# EAGLE design stepper_board (EAGLE 6.6.0)
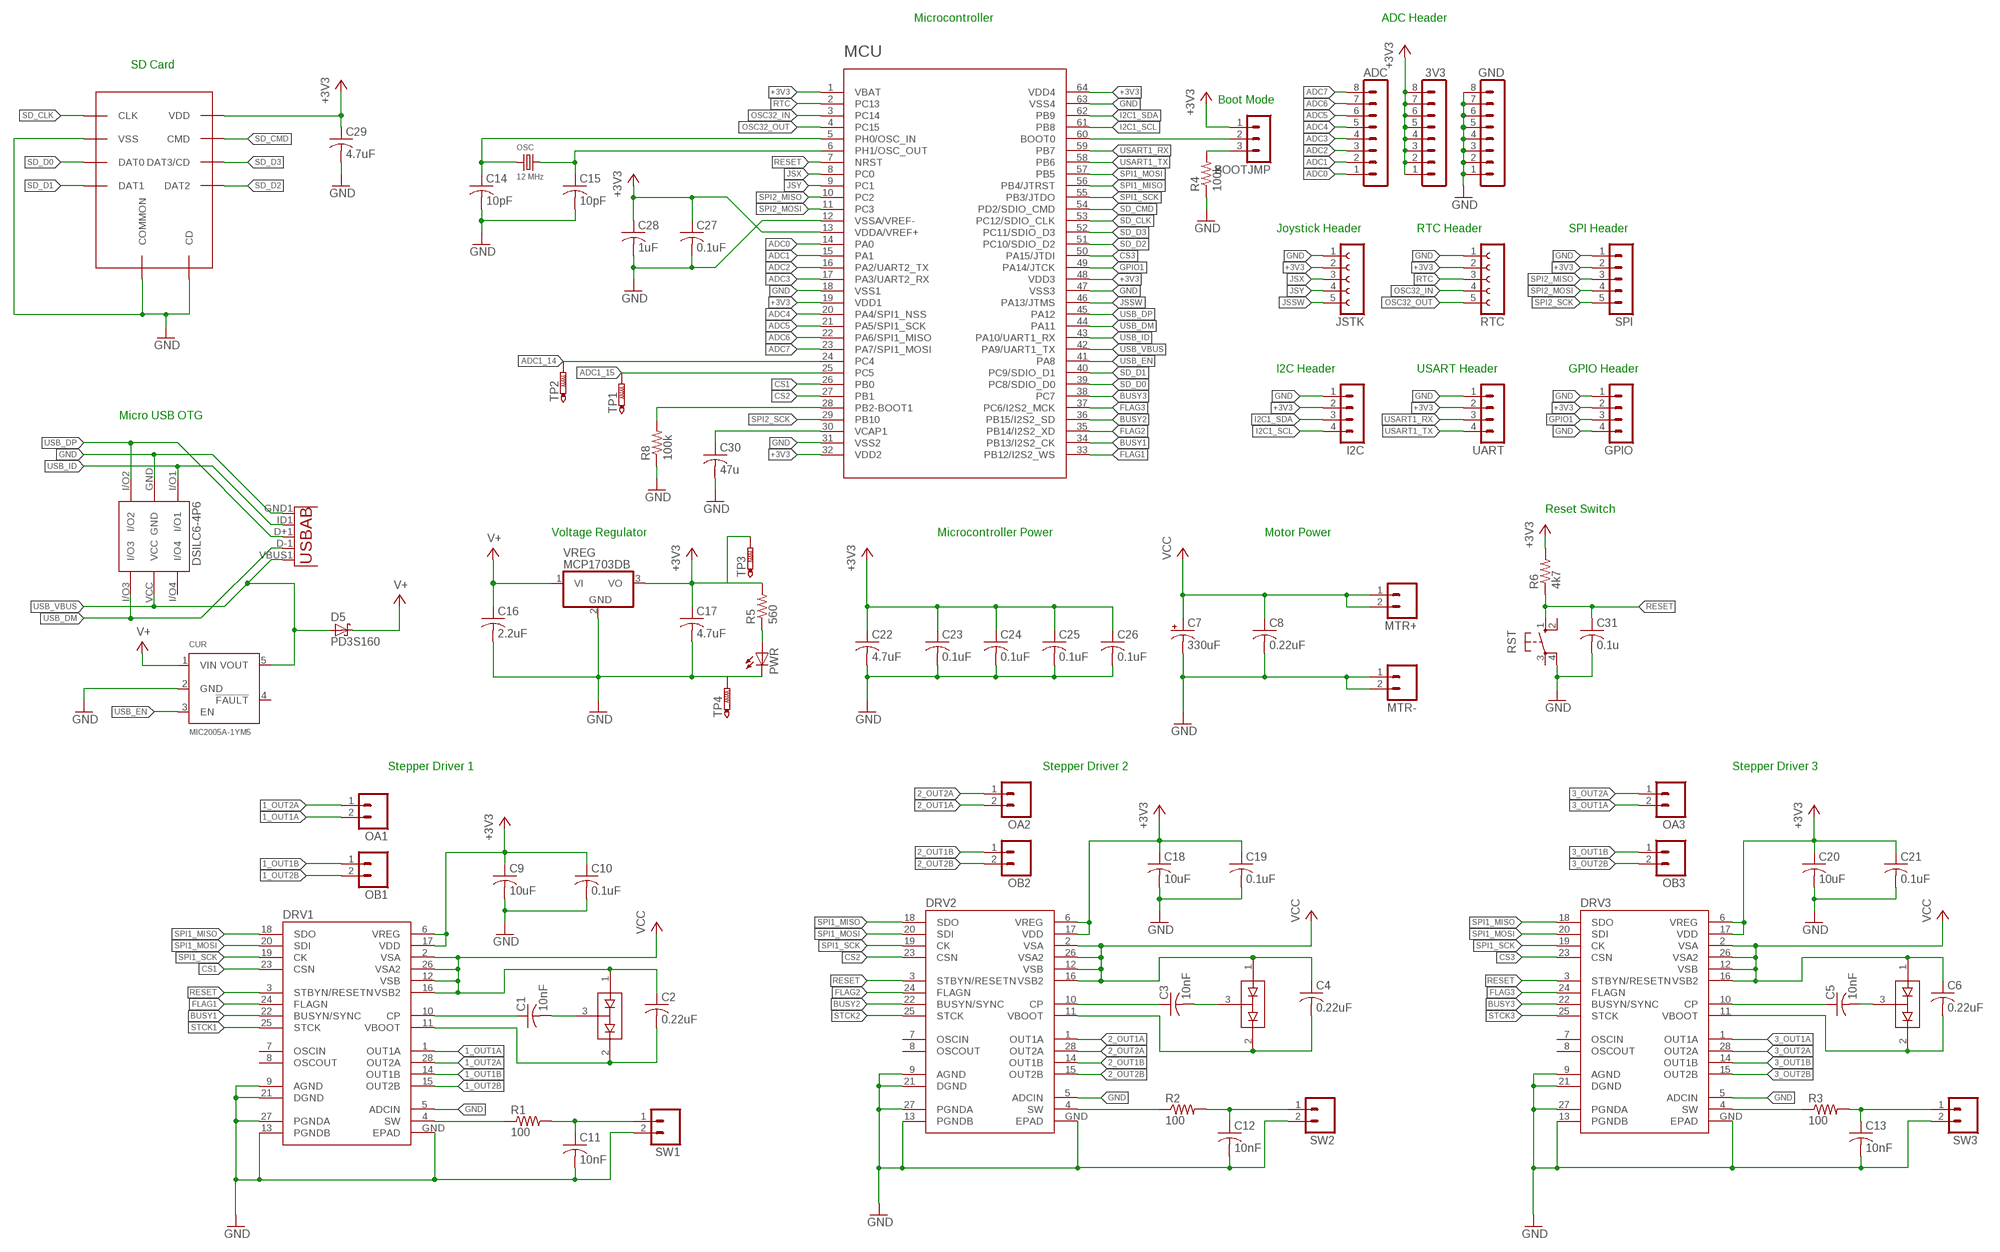
[diagram p0: schematic, sheet 1]

## Parts
3V3  MA08-1  [MA08-1]
ADC  MA08-1  [MA08-1]
BOOTJMP  MA03-1  [MA03-1]
C1  10nF  C-USC0805  [C0805]
C2  0.22uF  C-USC0805  [C0805]
C3  10nF  C-USC0805  [C0805]
C4  0.22uF  C-USC0805  [C0805]
C5  10nF  C-USC0805  [C0805]
C6  0.22uF  C-USC0805  [C0805]
C7  330uF  CPOL-USUD-10X10  [UD-10X10_NICHICON]
C8  0.22uF  C-USC0805  [C0805]
C9  10uF  C-USC0805  [C0805]
C10  0.1uF  C-USC0805  [C0805]
C11  10nF  C-USC0805  [C0805]
C12  10nF  C-USC0805  [C0805]
C13  10nF  C-USC0805  [C0805]
C14  10pF  C-USC0805  [C0805]
C15  10pF  C-USC0805  [C0805]
C16  2.2uF  C-USC0805  [C0805]
C17  4.7uF  C-USC0805  [C0805]
C18  10uF  C-USC0805  [C0805]
C19  0.1uF  C-USC0805  [C0805]
C20  10uF  C-USC0805  [C0805]
C21  0.1uF  C-USC0805  [C0805]
C22  4.7uF  C-USC0805  [C0805]
C23  0.1uF  C-USC0805  [C0805]
C24  0.1uF  C-USC0805  [C0805]
C25  0.1uF  C-USC0805  [C0805]
C26  0.1uF  C-USC0805  [C0805]
C27  0.1uF  C-USC0805  [C0805]
C28  1uF  C-USC0805  [C0805]
C29  4.7uF  C-USC0805  [C0805]
C30  47u  C-USC0805  [C0805]
C31  0.1u  C-USC0805  [C0805]
CUR  MIC2005A-1YM5  [SOT23-5]
D1  BAV99  [SOT23]
D2  BAV99  [SOT23]
D3  BAV99  [SOT23]
D5  PD3S160  [POWERDI323]
DRV1  L6470  [HTSSOP28-NOPAD]
DRV2  L6470  [HTSSOP28-NOPAD]
DRV3  L6470  [HTSSOP28-NOPAD]
ESD  DSILC6-4P6  [SOT-666]
GND  MA08-1  [MA08-1]
GPIO  MA04-1  [MA04-1]
I2C  MA04-1  [MA04-1]
JSTK  FE05-1  [FE05-1]
MCU  STM32F411RE  [TQFP64]
MICROSD  SCHA5B0200  [SCHA5B0200]
MTR+  M02  [02P]
MTR-  M02  [02P]
OA1  M02  [02P]
OA2  M02  [02P]
OA3  M02  [02P]
OB1  M02  [02P]
OB2  M02  [02P]
OB3  M02  [02P]
OSC  12 MHz  CRYSTAL.3.2X2.5MM  [3.2X2.5MM]
PWR  LEDCHIP-LED0805  [CHIP-LED0805]
R1  100  R-US_R0805  [R0805]
R2  100  R-US_R0805  [R0805]
R3  100  R-US_R0805  [R0805]
R4  100k  R-US_R0805  [R0805]
R5  560  R-US_R0805  [R0805]
R6  4k7  R-US_R0805  [R0805]
R8  100k  R-US_R0805  [R0805]
RST  10-XX  [B3F-10XX]
RTC  FE05-1  [FE05-1]
SPI  MA05-1  [MA05-1]
SW1  M02  [02P]
SW2  M02  [02P]
SW3  M02  [02P]
TP1  PTR1B1,27  [B1,27]
TP2  PTR1B1,27  [B1,27]
TP3  PTR1B1,27  [B1,27]
TP4  PTR1B1,27  [B1,27]
UART  MA04-1  [MA04-1]
USB  USB""  [USB-MICRO-SMD]
VREG  MCP1703DB  [SOT223]

## Nets
1_OUT1A: DRV1.1(OUT1A) OA1.2
1_OUT1B: DRV1.14(OUT1B) OB1.1
1_OUT2A: DRV1.28(OUT2A) OA1.1
1_OUT2B: DRV1.15(OUT2B) OB1.2
2_OUT1A: DRV2.1(OUT1A) OA2.2
2_OUT1B: DRV2.14(OUT1B) OB2.1
2_OUT2A: DRV2.28(OUT2A) OA2.1
2_OUT2B: DRV2.15(OUT2B) OB2.2
3_OUT1A: DRV3.1(OUT1A) OA3.2
3_OUT1B: DRV3.14(OUT1B) OB3.1
3_OUT2A: DRV3.28(OUT2A) OA3.1
3_OUT2B: DRV3.15(OUT2B) OB3.2
+3V3: 3V3.1 3V3.2 3V3.3 3V3.4 3V3.5 3V3.6 3V3.7 3V3.8 BOOTJMP.1 C9.1 C10.1 C17.1 C18.1 C19.1 C20.1 C21.1 C22.1 C23.1 C24.1 C25.1 C26.1 C27.1 C28.1 C29.1 DRV1.6(VREG) DRV1.17(VDD) DRV2.6(VREG) DRV2.17(VDD) DRV3.6(VREG) DRV3.17(VDD) GPIO.2 I2C.2 JSTK.2 MCU.1(VBAT) MCU.13(VDDA/VREF+) MCU.19(VDD1) MCU.32(VDD2) MCU.48(VDD3) MCU.64(VDD4) MICROSD.VDD R5.2 R6.2 RTC.2 SPI.2 TP3.TP UART.2 VREG.3(VO)
ADC0: ADC.1 MCU.14(PA0)
ADC1: ADC.2 MCU.15(PA1)
ADC1_14: MCU.24(PC4) TP2.TP
ADC1_15: MCU.25(PC5) TP1.TP
ADC2: ADC.3 MCU.16(PA2/UART2_TX)
ADC3: ADC.4 MCU.17(PA3/UART2_RX)
ADC4: ADC.5 MCU.20(PA4/SPI1_NSS)
ADC5: ADC.6 MCU.21(PA5/SPI1_SCK)
ADC6: ADC.7 MCU.22(PA6/SPI1_MISO)
ADC7: ADC.8 MCU.23(PA7/SPI1_MOSI)
BUSY1: DRV1.22(BUSYN/SYNC) MCU.34(PB13/I2S2_CK)
BUSY2: DRV2.22(BUSYN/SYNC) MCU.36(PB15/I2S2_SD)
BUSY3: DRV3.22(BUSYN/SYNC) MCU.38(PC7)
CS1: DRV1.23(CSN) MCU.26(PB0)
CS2: DRV2.23(CSN) MCU.27(PB1)
CS3: DRV3.23(CSN) MCU.50(PA15/JTDI)
FLAG1: DRV1.24(FLAGN) MCU.33(PB12/I2S2_WS)
FLAG2: DRV2.24(FLAGN) MCU.35(PB14/I2S2_XD)
FLAG3: DRV3.24(FLAGN) MCU.37(PC6/I2S2_MCK)
GND: C7.- C8.2 C9.2 C10.2 C11.2 C12.2 C13.2 C14.2 C15.2 C16.2 C17.2 C18.2 C19.2 C20.2 C21.2 C22.2 C23.2 C24.2 C25.2 C26.2 C27.2 C28.2 C29.2 C30.2 C31.2 CUR.2(GND) DRV1.5(ADCIN) DRV1.9(AGND) DRV1.13(PGNDB) DRV1.21(DGND) DRV1.27(PGNDA) DRV1.GND(EPAD) DRV2.5(ADCIN) DRV2.9(AGND) DRV2.13(PGNDB) DRV2.21(DGND) DRV2.27(PGNDA) DRV2.GND(EPAD) DRV3.5(ADCIN) DRV3.9(AGND) DRV3.13(PGNDB) DRV3.21(DGND) DRV3.27(PGNDA) DRV3.GND(EPAD) ESD.GND GND.1 GND.2 GND.3 GND.4 GND.5 GND.6 GND.7 GND.8 GPIO.1 GPIO.4 I2C.1 JSTK.1 MCU.12(VSSA/VREF-) MCU.18(VSS1) MCU.31(VSS2) MCU.47(VSS3) MCU.63(VSS4) MICROSD.CD_SW(CD) MICROSD.COMMON MICROSD.VSS MTR-.1 MTR-.2 PWR.C R4.1 R8.1 RST.4(P1) RTC.1 SPI.1 SW1.2 SW2.2 SW3.2 TP4.TP UART.1 USB.GND1(GND) VREG.2(GND)
GPIO1: GPIO.3 MCU.49(PA14/JTCK)
I2C1_SCL: I2C.4 MCU.61(PB8)
I2C1_SDA: I2C.3 MCU.62(PB9)
JSSW: JSTK.5 MCU.46(PA13/JTMS)
JSX: JSTK.3 MCU.8(PC0)
JSY: JSTK.4 MCU.9(PC1)
N$1: C1.1 DRV1.10(CP)
N$2: C1.2 D1.3(COM)
N$3: C2.2 D1.2(C2) DRV1.11(VBOOT)
N$4: C3.1 DRV2.10(CP)
N$5: C3.2 D2.3(COM)
N$6: C4.2 D2.2(C2) DRV2.11(VBOOT)
N$7: DRV1.4(SW) R1.1
N$8: C5.1 DRV3.10(CP)
N$9: C5.2 D3.3(COM)
N$10: C6.2 D3.2(C2) DRV3.11(VBOOT)
N$11: C11.1 R1.2 SW1.1
N$12: DRV2.4(SW) R2.1
N$13: C12.1 R2.2 SW2.1
N$14: DRV3.4(SW) R3.1
N$15: C13.1 R3.2 SW3.1
N$16: C14.1 MCU.5(PH0/OSC_IN) OSC.1
N$17: C15.1 MCU.6(PH1/OSC_OUT) OSC.3
N$18: BOOTJMP.2 MCU.60(BOOT0)
N$19: BOOTJMP.3 R4.2
N$20: PWR.A R5.1
N$22: C30.1 MCU.30(VCAP1)
N$23: MCU.28(PB2-BOOT1) R8.2
OSC32_IN: MCU.3(PC14) RTC.4
OSC32_OUT: MCU.4(PC15) RTC.5
RESET: C31.1 DRV1.3(STBYN/RESETN) DRV2.3(STBYN/RESETN) DRV3.3(STBYN/RESETN) MCU.7(NRST) R6.1 RST.1(S)
RTC: MCU.2(PC13) RTC.3
SD_CLK: MCU.53(PC12/SDIO_CLK) MICROSD.CLK
SD_CMD: MCU.54(PD2/SDIO_CMD) MICROSD.CMD
SD_D0: MCU.39(PC8/SDIO_D0) MICROSD.DAT0
SD_D1: MCU.40(PC9/SDIO_D1) MICROSD.DAT1
SD_D2: MCU.51(PC10/SDIO_D2) MICROSD.DAT2
SD_D3: MCU.52(PC11/SDIO_D3) MICROSD.DAT3/CD
SPI1_MISO: DRV1.18(SDO) DRV2.18(SDO) DRV3.18(SDO) MCU.56(PB4/JTRST)
SPI1_MOSI: DRV1.20(SDI) DRV2.20(SDI) DRV3.20(SDI) MCU.57(PB5)
SPI1_SCK: DRV1.19(CK) DRV2.19(CK) DRV3.19(CK) MCU.55(PB3/JTDO)
SPI2_MISO: MCU.10(PC2) SPI.3
SPI2_MOSI: MCU.11(PC3) SPI.4
SPI2_SCK: MCU.29(PB10) SPI.5
STCK1: DRV1.25(STCK)
STCK2: DRV2.25(STCK)
STCK3: DRV3.25(STCK)
USART1_RX: MCU.59(PB7) UART.3
USART1_TX: MCU.58(PB6) UART.4
USB_DM: ESD.I/O3 MCU.44(PA11) USB.D-1(D-)
USB_DP: ESD.I/O2 MCU.45(PA12) USB.D+1(D+)
USB_EN: CUR.3(EN) MCU.41(PA8)
USB_ID: ESD.I/O1 MCU.43(PA10/UART1_RX) USB.ID1(USBID)
USB_VBUS: CUR.5(VOUT) D5.A ESD.VCC MCU.42(PA9/UART1_TX) USB.VBUS1(VBUS)
V+: C16.1 CUR.1(VIN) D5.C VREG.1(VI)
VCC: C2.1 C4.1 C6.1 C7.+ C8.1 D1.1(A1) D2.1(A1) D3.1(A1) DRV1.2(VSA) DRV1.12(VSB) DRV1.16(VSB2) DRV1.26(VSA2) DRV2.2(VSA) DRV2.12(VSB) DRV2.16(VSB2) DRV2.26(VSA2) DRV3.2(VSA) DRV3.12(VSB) DRV3.16(VSB2) DRV3.26(VSA2) MTR+.1 MTR+.2
Unconnected: CUR.4(!FAULT) DRV1.7(OSCIN) DRV1.8(OSCOUT) DRV2.7(OSCIN) DRV2.8(OSCOUT) DRV3.7(OSCIN) DRV3.8(OSCOUT) ESD.I/O4 RST.2(S1) RST.3(P)

## Notes on the sheet
- Microcontroller | ADC Header
- SD Card
- Boot Mode
- Joystick Header | RTC Header | SPI Header
- I2C Header | USART Header | GPIO Header
- Micro USB OTG
- Reset Switch
- Voltage Regulator | Microcontroller Power | Motor Power
- Stepper Driver 1 | Stepper Driver 2 | Stepper Driver 3

## Library data of the parts
3V3 ADC GND = con-lstb:MA08-1: PIN HEADER; OC_FARNELL: unknown; OC_NEWARK: unknown
BOOTJMP = con-lstb:MA03-1: PIN HEADER; OC_FARNELL: unknown; OC_NEWARK: unknown
C1-C6 C8-C31 = rcl:C-US: CAPACITOR, American symbol
C7 = rcl:CPOL-US: POLARIZED CAPACITOR, American symbol
CUR = Power_Switch:MIC2005A-1: 0.5A Current Limiting Power Distribution Switch Current limit 0.5A, Enable signal active high; RS: 727-4731
D1-D3 = DiscreteSemi:BAV99: Two small signal silicon diodes connected anode to cathode. Connections to all three nodes available.
D5 = diode:PD3S160: 1.0A SURFACE MOUNT SCHOTTKY BARRIER RECTIFIER POWERDI ® 323 Source: http://www.diodes.com/datasheets/ds30899.pdf
DRV1-DRV3 = PowerIC_spark:L6470: 3A RMS/7A peak bipolar stepper motor driver with SPI control and step input in HTSSOP-28 package. IC-10648
ESD = Stepper_Driver:DSILC6-4P6: ESD Protection IC for high speed interface (i.e. USB, Ethernet, display and camera serial interfaces.
GPIO I2C UART = con-lstb:MA04-1: PIN HEADER; OC_FARNELL: unknown; OC_NEWARK: unknown
JSTK RTC = con-lsta:FE05-1: FEMALE HEADER; OC_FARNELL: unknown; OC_NEWARK: unknown
MCU = DigitalIC:STM32F411RE: 100MHz ARM Cortex M4 with 512kb flash and 128kb RAM
MICROSD = SCHA5B0200_hand:SCHA5B0200: Memory Card Connectors microSD Rev Mount Push-push w/Switch; MANUF: ALPS; PARTNUM: SCHA5B0200
MTR+ MTR- OA1-OA3 OB1-OB3 SW1-SW3 = con-amp-quick:M02: AMP QUICK CONNECTOR; OC_FARNELL: unknown; OC_NEWARK: unknown
OSC = abracon:CRYSTAL
PWR = led:LED: LED OSRAM: - CHIPLED LG R971, LG N971, LY N971, LG Q971, LY Q971, LO R971, LY R971 LH N974, LH R974 LS Q976, LO Q976, LY Q976 LO Q996 - Hyper CHIPLED LW Q18S LB Q993, LB Q99A, LB R99A - SideLED LS A670, LO A670, LY A670, LG A670, LP A670 LB A673, LV A673, LT A673, LW A673 LH A674 LY A675 LS A676, LA A676, LO A676, LY A676, LW A676 LS A679, LY A679, LG A679 - Hyper Micro SIDELED® LS Y876, LA Y876, LO Y876, LY Y876 LT Y87S - SmartLED LW L88C, LW L88S LB L89C, LB L89S, LG L890 LS L89K, LO L89K, LY L89K LS L896, LA L896, LO L896, LY L896 - TOPLED LS T670, LO T670, LY T670, LG T670, LP T670 LSG T670, LSP T670, LSY T670, LOP T670, LYG T670 LG T671, LOG T671, LSG T671 LB T673, LV T673, LT T673, LW T673 LH T674 LS T676, LA T676, LO T676, LY T676, LB T676, LH T676, LSB T676, LW T676 LB T67C, LV T67C, LT T67C, LS T67K, LO T67K, LY T67K, LW E67C LS E67B, LA E67B, LO E67B, LY E67B, LB E67C, LV E67C, LT E67C LW T67C LS T679, LY T679, LG T679 LS T770, LO T770, LY T770, LG T770, LP T770 LB T773, LV T773, LT T773, LW T773 LH T774 LS E675, LA E675, LY E675, LS T675 LS T776, LA T776, LO T776, LY T776, LB T776 LHGB T686 LT T68C, LB T68C - Hyper Mini TOPLED® LB M676 - Mini TOPLED Santana® LG M470 LS M47K, LO M47K, LY M47K Source: http://www.osram.convergy.de LUXEON: - LUMILED® LXK2-PW12-R00, LXK2-PW12-S00, LXK2-PW14-U00, LXK2-PW14-V00 LXK2-PM12-R00, LXK2-PM12-S00, LXK2-PM14-U00 LXK2-PE12-Q00, LXK2-PE12-R00, LXK2-PE12-S00, LXK2-PE14-T00, LXK2-PE14-U00 LXK2-PB12-K00, LXK2-PB12-L00, LXK2-PB12-M00, LXK2-PB14-N00, LXK2-PB14-P00, LXK2-PB14-Q00 LXK2-PR12-L00, LXK2-PR12-M00, LXK2-PR14-Q00, LXK2-PR14-R00 LXK2-PD12-Q00, LXK2-PD12-R00, LXK2-PD12-S00 LXK2-PH12-R00, LXK2-PH12-S00 LXK2-PL12-P00, LXK2-PL12-Q00, LXK2-PL12-R00 Source: www.luxeon.com KINGBRIGHT: KA-3528ASYC Source: www.kingbright.com
R1-R3 = resistor:R-US_: RESISTOR, American symbol
R4-R6 R8 = rcl:R-US_: RESISTOR, American symbol
RST = switch-omron:10-XX: OMRON SWITCH; MPN: B3F-1000; OC_FARNELL: 176432; OC_NEWARK: 36M3542
SPI = con-lstb:MA05-1: PIN HEADER; OC_FARNELL: unknown; OC_NEWARK: unknown
TP1-TP4 = testpad:PTR1: TEST PIN
USB = MicroUSB:USB: This is a USB AB connector that is compatible with USB OTG. i.e. this connector can serve as a host or device
VREG = linear:MCP1703: 250 mA, 16V, Low Quiescent Current LDO Regulator Source: http://ww1.microchip.com/downloads/en/DeviceDoc/22049b.pdf

## Board
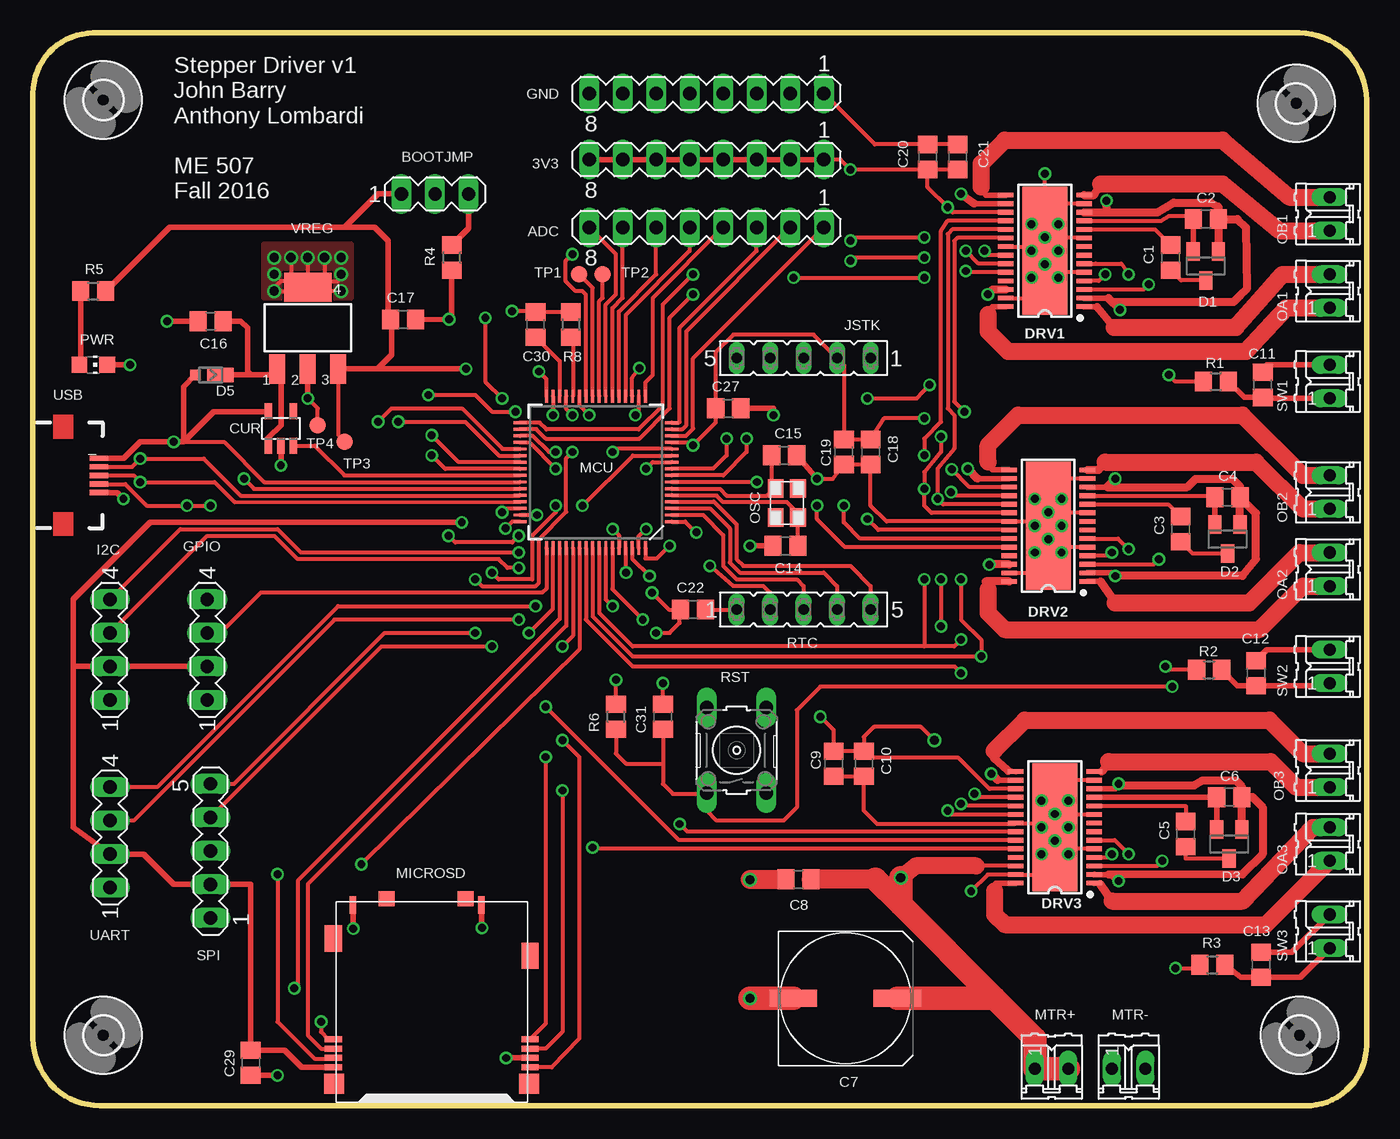
[diagram p1: board, top side]
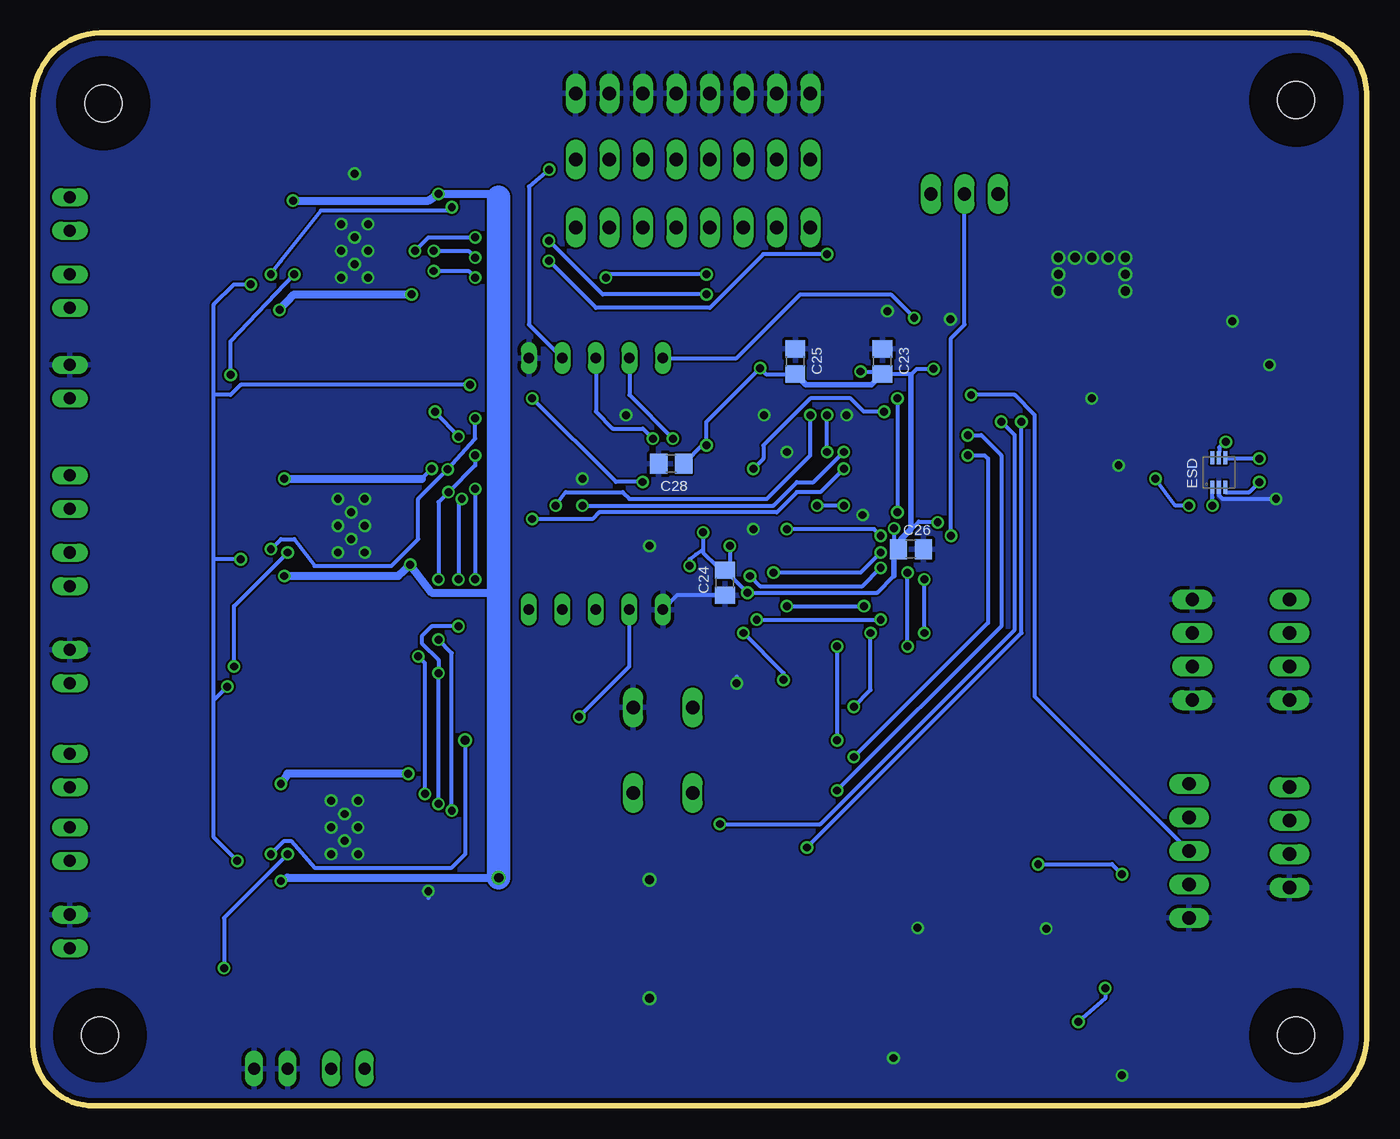
[diagram p2: board, bottom side, seen from below]

Size 101.09 x 81.31 mm. Coordinates in mm from the lower left corner, seen from the top.
Outline: 5.08,0.03 arc-90 0,5.11 0,76.73 arc-90 4.57,81.31 96.01,81.31 arc-90 101.09,76.23 101.09,4.6 arc-96 96.01,0.03 5.08,0.03
Copper layers (1*16): Top 0.0356mm / dielectric 1.5011mm / Bottom 0.0356mm
Design rules "oshpark-2layer": minimum track width 6mil, minimum drill 13mil, track to track 6mil, track to pad 6mil, pad to pad 6mil, via to via 6mil, smd to smd 6mil, copper to edge 15mil, drill to drill 6mil, minimum pad ring 7mil, minimum via ring 7mil, stop-mask expansion 2.5mil, vias tented up to drill 0mil, thermal gap 10mil

### Footprints (pad centres in the part's own frame; a part is rotated, then mirrored left to right if it is on the bottom)
MA08-1 = drill 1.016 long: 1 -8.89,0; 2 -6.35,0; 3 -3.81,0; 4 -1.27,0; 5 1.27,0; 6 3.81,0; 7 6.35,0; 8 8.89,0
MA03-1 = drill 1.016 long: 1 -2.54,0; 2 0,0; 3 2.54,0
C0805 = smd 1.3 x 1.5: 1 -0.95,0; 2 0.95,0
UD-10X10_NICHICON = smd 3.6 x 1.3: + 3.925,0; - -3.95,0
SOT23-5 = smd 0.55 x 1.2: 1 -0.95,-1.3; 2 0,-1.3; 3 0.95,-1.3; 4 0.95,1.3; 5 -0.95,1.3
SOT23 = smd 1 x 1.4: 1 -0.95,-1.1; 2 0.95,-1.1; 3 0,1.1
POWERDI323 = smd 0.8 x 0.8: A 1.15,0 | smd 2 x 1.1: C -0.75,0
HTSSOP28-NOPAD = smd 0.36 x 1.19: 1 -4.225,-2.97; 2 -3.575,-2.97; 3 -2.925,-2.97; 4 -2.275,-2.97; 5 -1.625,-2.97; 6 -0.975,-2.97; 7 -0.325,-2.97; 8 0.325,-2.97; 9 0.975,-2.97; 10 1.625,-2.97; 11 2.275,-2.97; 12 2.925,-2.97; 13 3.575,-2.97; 14 4.225,-2.97; 15 4.225,2.97; 16 3.575,2.97; 17 2.925,2.97; 18 2.275,2.97; 19 1.625,2.97; 20 0.975,2.97; 21 0.325,2.97; 22 -0.325,2.97; 23 -0.975,2.97; 24 -1.625,2.97; 25 -2.275,2.97; 26 -2.925,2.97; 27 -3.575,2.97; 28 -4.225,2.97 | smd 9.7 x 3.4: GND 0,0
SOT-666 = smd 1 x 0.3: GND -1.12,0.02; I/O1 -1.12,0.52; I/O2 -1.12,-0.48; I/O3 1.12,-0.48; I/O4 1.12,0.52; VCC 1.12,0.02
MA04-1 = drill 1.016 long: 1 -3.81,0; 2 -1.27,0; 3 1.27,0; 4 3.81,0
FE05-1 = drill 0.813 long: 1 -5.08,0; 2 -2.54,0; 3 0,0; 4 2.54,0; 5 5.08,0
TQFP64 = smd 0.22 x 1: 1 -3.75,-5.75; 2 -3.25,-5.75; 3 -2.75,-5.75; 4 -2.25,-5.75; 5 -1.75,-5.75; 6 -1.25,-5.75; 7 -0.75,-5.75; 8 -0.25,-5.75; 9 0.25,-5.75; 10 0.75,-5.75; 11 1.25,-5.75; 12 1.75,-5.75; 13 2.25,-5.75; 14 2.75,-5.75; 15 3.25,-5.75; 16 3.75,-5.75; 33 3.75,5.75; 34 3.25,5.75; 35 2.75,5.75; 36 2.25,5.75; 37 1.75,5.75; 38 1.25,5.75; 39 0.75,5.75; 40 0.25,5.75; 41 -0.25,5.75; 42 -0.75,5.75; 43 -1.25,5.75; 44 -1.75,5.75; 45 -2.25,5.75; 46 -2.75,5.75; 47 -3.25,5.75; 48 -3.75,5.75 | smd 1 x 0.22: 17 5.75,-3.75; 18 5.75,-3.25; 19 5.75,-2.75; 20 5.75,-2.25; 21 5.75,-1.75; 22 5.75,-1.25; 23 5.75,-0.75; 24 5.75,-0.25; 25 5.75,0.25; 26 5.75,0.75; 27 5.75,1.25; 28 5.75,1.75; 29 5.75,2.25; 30 5.75,2.75; 31 5.75,3.25; 32 5.75,3.75; 49 -5.75,3.75; 50 -5.75,3.25; 51 -5.75,2.75; 52 -5.75,2.25; 53 -5.75,1.75; 54 -5.75,1.25; 55 -5.75,0.75; 56 -5.75,0.25; 57 -5.75,-0.25; 58 -5.75,-0.75; 59 -5.75,-1.25; 60 -5.75,-1.75; 61 -5.75,-2.25; 62 -5.75,-2.75; 63 -5.75,-3.25; 64 -5.75,-3.75
SCHA5B0200 = smd 0.5 x 1.3: CD_SW -5.975,13.55; COMMON 3.775,13.55 | smd 1.3 x 0.45: CLK 7.45,1.265; CMD -7.45,1.965; DAT0 7.45,2.665; DAT1 7.45,3.365; DAT2 -7.45,3.365; DAT3/CD -7.45,2.665; VDD -7.45,1.265; VSS 7.45,1.965 | smd 1.5 x 1.5: P$1 -7.388,0; P$2 7.388,0 | smd 1.3 x 2: P$11 -7.45,11; P$12 7.45,9.7 | smd 1.2 x 1.15: P$15 -3.425,14.025; P$16 2.575,14.025
02P = drill 0.914 long: 1 -1.27,0; 2 1.27,0
3.2X2.5MM = smd 1.4 x 1.2: 1 -1.1,-0.85; 2 1.1,-0.85; 3 1.1,0.85; 4 -1.1,0.85
CHIP-LED0805 = smd 1.2 x 1.2: A 0,-1.05; C 0,1.05
R0805 = smd 1.3 x 1.5: 1 -0.95,0; 2 0.95,0
B3F-10XX = drill 1.016 long: 1 -3.251,2.261; 2 3.251,2.261; 3 -3.251,-2.261; 4 3.251,-2.261
MA05-1 = drill 1.016 long: 1 -5.08,0; 2 -2.54,0; 3 0,0; 4 2.54,0; 5 5.08,0
B1,27 = smd 1.27 x 1.27: TP 0,0
2,8 = hole 2.8: 0,0
USB-MICRO-SMD = smd 1.4 x 0.4: D+1 2.7,0; D-1 2.7,0.65; GND1 2.7,-1.3; ID1 2.7,-0.65; VBUS1 2.7,1.3
SOT223 = smd 1.219 x 2.235: 1 -2.311,-3.099; 2 0,-3.099; 3 2.311,-3.099 | smd 3.6 x 2.2: 4 0,3.099

### Placement (x,y rotation side)
3V3  51.05,71.7 180 top
ADC  51.05,66.57 180 top
BOOTJMP  30.48,69.11 0 top
C1  86.23,64.29 270 top
C2  88.9,67.21 180 top
C3  86.99,43.71 270 top
C4  90.55,46.13 180 top
C5  87.38,20.6 270 top
C6  90.68,23.39 180 top
C7  61.6,8.15 0 top
C8  58.04,17.17 180 top
C9  60.71,25.93 270 top
C10  62.99,25.93 270 top
C11  93.22,54.64 90 top
C12  92.71,32.79 90 top
C13  93.09,10.69 90 top
C14  57.05,42.44 180 top
C15  56.95,49.3 0 top
C16  13.46,59.46 180 top
C17  28.07,59.59 0 top
C18  63.5,49.56 270 top
C19  61.47,49.56 270 top
C20  67.82,71.91 90 top
C21  70.1,71.91 90 top
C22  50.04,37.62 0 top
C23  36.7,56.41 90 bottom
C24  48.64,39.65 270 bottom
C25  43.31,56.41 90 bottom
C26  34.54,42.19 0 bottom
C27  52.71,52.86 0 top
C28  52.71,48.67 180 bottom
C29  16.51,3.28 270 top
C30  38.1,59.21 90 top
C31  47.75,29.49 90 top
CUR  18.8,51.33 0 top
D1  88.9,63.65 180 top
D2  90.55,42.95 180 top
D3  90.68,19.84 180 top
D5  13.46,55.4 180 top
DRV1  76.71,64.8 90 top
DRV2  76.96,43.97 90 top
DRV3  77.47,21.11 90 top
ESD  11.18,48.01 90 bottom
GND  51.05,76.73 180 top
GPIO  13.21,34.57 90 top
I2C  5.84,34.57 90 top
JSTK  58.42,56.67 180 top
MCU  42.67,48.03 90 top
MICROSD  30.23,1.68 0 top
MTR+  77.22,2.82 0 top
MTR-  83.06,2.82 0 top
OA1  98.3,61.75 90 top
OA2  98.3,40.67 90 top
OA3  98.3,19.84 90 top
OB1  98.3,67.59 90 top
OB2  98.3,46.51 90 top
OB3  98.3,25.43 90 top
OSC  57.15,45.69 90 top
PWR  4.57,56.16 270 top
R1  89.66,54.89 0 top
R2  89.15,33.05 0 top
R3  89.41,10.69 0 top
R4  31.75,64.29 90 top
R5  4.57,61.75 0 top
R6  44.2,29.49 90 top
R8  40.77,59.21 270 top
RST  53.34,26.95 90 top
RTC  58.42,37.62 0 top
SPI  13.46,19.33 90 top
SW1  98.3,54.89 90 top
SW2  98.3,33.3 90 top
SW3  98.3,13.23 90 top
TP1  41.4,63.02 0 top
TP2  43.18,63.02 0 top
TP3  23.62,50.32 0 top
TP4  21.59,51.59 0 top
U$2  [2,8]  96.01,5.36 0 top
U$3  [2,8]  5.33,5.36 0 top
U$4  [2,8]  5.33,76.23 0 top
U$5  [2,8]  95.76,75.97 0 top
UART  5.84,20.35 90 top
USB  2.29,47.78 0 top
VREG  20.83,58.95 0 top

### Tracks (layer width: path | path; a pad name or v marks a point on that pad's centre or on a via)
1_OUT1A
  Top 0.406: DRV1.1 80.63,60.57 80.67,60.53
  Top 0.61: 81.94,59 80.67,60.53
  Top 1.27: 81.94,59 91.19,59 94.74,63.02 OA1.2
1_OUT1B
  Top 0.61: DRV1.14 80.42,69.02 80.92,69.88
  Top 1.27: 80.92,69.88 90.17,69.88 94.49,66.32 OB1.1
1_OUT2A
  Top 0.406: DRV1.28 72.74,60.57 72.39,59.97
  Top 1.27: 72.39,59.97 72.39,58.7 73.91,57.18 91.95,57.18 95,60.48 OA1.1
1_OUT2B
  Top 0.406: DRV1.15 72.23,69.02 71.88,69.62
  Top 1.27: 71.88,69.62 71.88,71.4 73.66,73.18 90.17,73.18 95.25,68.86 OB1.2
2_OUT1A
  Top 0.406: DRV2.1 80.93,39.74
  Top 0.61: 80.93,39.74 82.04,38.13
  Top 1.27: 82.04,38.13 92.2,38.13 96.01,41.94 OA2.2
2_OUT1B
  Top 0.61: DRV2.14 80.77,48.19 81.28,48.79
  Top 1.27: 81.28,48.79 92.71,48.79 96.27,45.24 OB2.1
2_OUT2A
  Top 0.61: DRV2.28 72.23,39.74 72.39,39.14
  Top 1.27: 72.39,39.14 72.39,37.36 73.66,36.09 92.96,36.09 96.27,39.4 OA2.1
2_OUT2B
  Top 0.406: DRV2.15 72.74,48.19 72.39,48.79
  Top 1.27: 72.39,48.79 72.39,50.06 74.68,52.35 91.69,52.35 96.27,47.78 OB2.2
3_OUT1A
  Top 0.406: DRV3.1 80.88,16.83
  Top 0.61: 80.88,16.83 81.79,15.52
  Top 1.27: 81.79,15.52 91.69,15.52 97.03,21.11 OA3.2
3_OUT1B
  Top 0.305: 81.03,25.33 DRV3.14
  Top 0.61: 81.53,26.09 81.03,25.33
  Top 1.27: 81.53,26.09 93.82,26.09 95.76,24.16 OB3.1
3_OUT2A
  Top 0.406: DRV3.28 72.99,16.88 72.9,16.28
  Top 1.27: 72.9,16.28 72.9,14.5 73.66,13.74 93.47,13.74 OA3.1
3_OUT2B
  Top 0.406: DRV3.15 73.91,25.38
  Top 0.61: 73.91,25.38 72.85,26.34 72.85,26.9
  Top 1.27: 72.85,26.9 75.18,29.24 93.73,29.24 96.27,26.7 OB3.2
+3V3  (via drill 0.6, 0.7)
  Top 0.305: MCU.19 45.42,55.19 v45.97,55.91 | MCU.32 38.92,55.08 v38.35,55.65 | MCU.64 46.42,41.49 47.3,41.49 v48.26,42.44 | MCU.1 49.43,44.27 50.24,43.46 v50.29,43.46 | RTC.2 55.88,38.89 55.37,39.4 53.09,39.4 v51.31,40.92 | MCU.48 36.33,44.28 v35.81,43.76 | DRV3.6 82,20.13 v83.06,19.08 | DRV3.17 72.51,24.03 70.17,26.38 63.5,26.38 C10.1 | C10.1 C9.1 60.71,28.47 v59.69,29.49 | DRV2.6 82.25,42.99 v83.06,42.19 | v67.56,52.1 64.52,52.1 C18.1 C19.1 61.47,56.16 JSTK.2 59.18,58.45 53.09,58.45 51.76,57.11 C27.1 51.76,51.78 v50.04,50.06 49.82,50.28 MCU.13 | DRV2.17 70.99,46.89 v69.65,48.23 | C21.1 C20.1 | DRV1.17 69.72,67.72 v69.34,68.1 67.82,69.62 C20.1 | DRV1.6 80.56,63.82 82.5,63.83 v83.06,63.02 | C20.1 v61.96,70.96 61.21,71.7 3V3.1 | v46.93,38.89 48.2,37.62 C22.1 49.02,37.55 49.02,36.6 48.26,35.84 v47.24,35.84 | VREG.3 23.14,50.85 TP3.TP | v68.33,27.71 67.31,28.73 63.75,28.73 62.99,27.97 C10.1 | R6.2 v44.2,32.28
  Top 0.406: VREG.3 26.11,55.85 | 26.11,55.85 27.18,56.92 27.18,59.53 C17.1 26.92,59.78 26.92,65.56 25.91,66.57 23.62,66.57 | 26.11,55.85 v32.82,55.85 | MICROSD.VDD 22.76,2.92 20.37,2.92 19.06,4.23 C29.1 16.51,16.79 SPI.2 10.67,16.79 8.38,19.08 UART.2 3.05,21.11 3.05,33.3 | 3V3.8 3V3.7 3V3.6 3V3.5 3V3.4 3V3.3 3V3.2 3V3.1 | 3.05,33.3 I2C.2 GPIO.2 | v32.51,44.22 8.89,44.22 3.05,38.38 3.05,33.3 | R5.2 10.35,66.57 23.62,66.57 | 23.62,66.57 26.16,69.11 BOOTJMP.1
  Bottom 0.305: v38.35,55.65 36.89,55.65 C23.1 34.61,55.46 34.54,55.4 34.09,55.85 v32.82,55.85 | v35.81,43.76 35.81,42.44 35.75,42.38 C26.1 | C28.1 50.36,50.06 v50.04,50.06 50.04,51.84 v45.97,55.91 45.53,55.46 C25.1 | v48.26,42.44 48.26,40.92 48.58,40.6 C24.1 | C24.1 v46.93,38.89 37.08,38.89 35.81,40.16 | v50.29,43.46 50.29,42.19 | 50.29,42.19 50.29,41.94 49.28,40.92 48.96,40.92 C24.1 | v32.51,44.22 32.56,44.27 33.93,44.27 35.26,42.95 35.31,42.95 35.75,42.51 C26.1 | v51.31,40.92 51.31,41.43 50.85,41.78 50.29,42.19 | v83.06,19.08 82.04,20.09 81.53,20.09 79.76,18.06 69.34,18.06 68.33,19.08 v68.33,27.71 | v83.06,42.19 82.3,42.95 81.28,42.95 79.76,40.92 73.91,40.92 71.88,42.95 71.88,46 v69.65,48.23 67.56,50.57 v67.56,52.1 | v83.06,63.02 82.3,64.03 79.25,67.84 69.6,67.84 v69.34,68.1 | C26.1 35.81,42.12 35.81,41.43 | v61.96,70.96 63.5,69.67 63.5,59.21 JSTK.2 | v59.69,29.49 55.88,33.3 RTC.2 | v44.2,32.28 44.2,32.79 v47.24,35.84
  Bottom 0.406: C25.1 42.48,54.64 37.53,54.64 C23.1 36.64,55.46 | 34.54,55.4 34.54,43.71 35.31,42.95 | 35.81,40.16 35.81,41.43
ADC0
  Top 0.305: MCU.14 49.49,50.78 50.04,51.33 50.04,56.67 ADC.1
ADC1
  Top 0.305: MCU.15 49.22,51.28 49.53,51.59 49.53,58.7 ADC.2
ADC1_14
  Top 0.305: MCU.24 42.92,60.98 43.18,61.24 TP2.TP
ADC1_15
  Top 0.305: MCU.25 42.42,62 TP1.TP
ADC2
  Top 0.305: MCU.16 48.96,51.78 49.02,51.84 49.02,58.95 54.86,64.8 ADC.3
ADC3
  Top 0.305: MCU.17 46.42,54.83 46.99,55.4 46.99,61.24 ADC.4
ADC4
  Top 0.305: ADC.5 49.78,64.8 44.92,59.93 MCU.20
ADC5
  Top 0.305: MCU.21 44.42,60.2 47.24,63.02 ADC.6
ADC6
  Top 0.305: MCU.22 43.92,60.46 44.7,61.24 ADC.7
ADC7
  Top 0.305: MCU.23 43.42,60.72 44.2,61.49 44.2,64.54 ADC.8
BUSY1  (via drill 0.6)
  Top 0.305: DRV1.22 72.46,64.47 v72.14,64.8 | v50.04,61.49 48.26,59.72 48.26,52.86 45.97,50.57 38.86,50.57 38.15,51.28 MCU.34 | v61.98,65.56 62.23,65.81 v67.56,65.81
  Bottom 0.305: v72.14,64.8 71.12,65.81 v67.56,65.81 | v50.04,61.49 57.91,61.49 v61.98,65.56
BUSY2  (via drill 0.6)
  Top 0.305: DRV2.22 64.08,43.64 v63.25,44.48 | MCU.36 37.63,50.28 v39.62,48.29
  Bottom 0.305: v39.62,48.29 41.4,46.51 43.18,46.51 44.7,44.98 58.17,44.98 58.67,44.48 v63.25,44.48
BUSY3  (via drill 0.6)
  Top 0.305: DRV3.22 49.6,20.78 v49.02,21.36 | v27.69,51.84 32.77,51.84 35.33,49.28 MCU.38
  Bottom 0.305: v49.02,21.36 41.4,21.36 26.67,36.09 26.67,50.83 v27.69,51.84
CS1  (via drill 0.6)
  Top 0.305: DRV1.23 71.69,63.82 v70.71,64.8 | v67.56,64.29 62.23,64.29 v61.98,64.03 | MCU.26 41.92,61.48 41.66,61.75 41.15,61.75 40.39,62.51 40.39,64.03 v40.89,64.54
  Bottom 0.305: v70.71,64.8 68.07,64.8 v67.56,64.29 | v61.98,64.03 58.42,60.48 49.78,60.48 45.72,64.54 v40.89,64.54
CS2  (via drill 0.6)
  Top 0.305: DRV2.23 62.7,42.99 61.47,44.22 v61.47,45.49 | v42.16,52.35 41.42,53.09 MCU.27
  Bottom 0.305: v61.47,45.49 60.71,46.51 56.39,46.51 55.88,46 45.47,46 42.16,49.3 v42.16,52.35
CS3  (via drill 0.6)
  Top 0.305: DRV3.23 48.98,20.13 v38.86,30.25 | v37.59,35.84 39.42,37.67 MCU.50
  Bottom 0.305: v38.86,30.25 37.59,31.52 v37.59,35.84
FLAG1  (via drill 0.6)
  Top 0.305: DRV1.24 70.86,63.17 v70.71,63.27 | v50.04,63.02 47.75,60.73 47.75,53.11 45.91,51.27 38.92,51.27 38.41,51.78 MCU.33 | v57.66,62.76 v67.56,62.76
  Bottom 0.305: v70.71,63.27 68.07,63.27 v67.56,62.76 | v50.04,63.02 57.4,63.02 v57.66,62.76
FLAG2  (via drill 0.6)
  Top 0.305: DRV2.24 61.57,42.34 59.44,44.48 v59.44,45.49 | v39.62,49.56 39.12,49.56 37.89,50.78 MCU.35
  Bottom 0.305: v59.44,45.49 44.96,45.49 43.18,47.27 41.91,47.27 v39.62,49.56
FLAG3  (via drill 0.6)
  Top 0.305: DRV3.24 42.52,19.48 v42.42,19.58 | v26.16,51.84 27.18,52.86 32.51,52.86 35.59,49.78 MCU.37
  Bottom 0.305: v42.42,19.58 26.16,35.84 v26.16,51.84
GND  (via drill 0.6, 0.7)
  Top 0.305: MCU.47 v38.2,44.78 | R8.1 C30.2 38.03,60.22 v36.32,60.22 | MCU.12 44.22,49.78 v43.94,49.56 | C22.2 RTC.1 | v71.12,16.28 72.37,17.53 DRV3.27 77.47,17.53 77.47,19.48 | DRV3.13 77.47,24.68 DRV3.GND | DRV3.9 77.47,22.08 DRV3.GND | DRV3.5 77.47,19.48 | 77.47,19.48 DRV3.GND | DRV3.GND 77.47,21.43 DRV3.21 74.43,21.36 64.01,21.36 62.99,22.38 C10.2 C9.2 | DRV2.13 76.96,47.54 v76.96,44.98 | DRV2.9 76.96,44.94 DRV2.GND 76.96,44.29 DRV2.21 64.7,44.29 63.5,45.49 C18.2 C19.2 60.64,47.52 v59.44,47.52 | DRV2.5 76.96,42.34 76.96,40.39 DRV2.27 | DRV1.5 76.71,63.17 76.71,61.22 DRV1.27 | DRV1.13 76.71,68.37 v76.71,70.64 | 76.71,65.77 DRV1.GND | C21.2 C20.2 63.82,72.86 GND.1 | MCU.63 45.92,43.15 v46.48,43.71 | MCU.31 39.42,52.86 v39.42,52.35 | MCU.18 45.92,52.6 v45.67,52.35 | TP4.TP 21.59,52.86 v20.83,53.62 | DRV1.21 76.38,65.12 DRV1.GND | DRV1.9 77.68,65.77 DRV1.GND | C31.2 v47.75,32.03 | v20.83,64.29 20.83,62.51 20.57,62.26 | v19.56,64.29 19.56,62.76 19.81,62.51 18.8,62.51 18.54,62.26 | v22.1,64.29 22.1,63.02 21.59,62.51 23.11,62.51 | v18.29,61.75 19.56,61.75 | v23.37,61.75 22.1,61.75
  Top 0.406: VREG.2 v20.83,53.62 | USB.GND1 6.38,46.48 v6.86,46 | C16.2 v10.16,59.46 | C17.2 v31.55,59.61 31.75,59.82 R4.1 | CUR.2 v18.8,48.54 | MICROSD.VSS v35.87,3.63 | MICROSD.CD_SW v24.28,13.44 | C29.2 18.53,2.33 v18.54,2.31 | C14.2 v54.36,42.44 | C15.2 v59.44,47.52 | PWR.C v7.37,56.16 | MICROSD.COMMON 34,13.52 v34.04,13.49 | C27.2 56.13,52.86 v56.13,52.35 | SW1.2 93.54,56.16 C11.2 | SW2.2 93.54,34.57 C12.2 | C13.2 95.44,11.64 SW3.2 | 76.96,42.34 v76.96,42.95 | 76.96,44.94 v76.96,44.98 | 76.71,63.17 v76.71,63.78 | v76.71,65.81 76.71,65.77
  Top 1.27: C8.2 56.81,17.15
  Top 1.422: 56.81,17.15 v54.36,17.15
  Top 1.778: C7.- v54.36,8.15
  Bottom 0.305: v71.12,16.28 71.12,15.77 | ESD.GND 11.2,46.27 10.92,46 v6.86,46 | C24.2 52.26,38.7 RTC.1 | v47.75,32.03 47.75,32.54
  other vias: 18.29,63.02 18.29,64.29 23.37,64.29 23.37,63.02 75.69,64.8 77.72,64.8 75.95,46 75.95,43.97 77.98,43.97 77.98,46 77.98,41.94 75.95,41.94 75.69,62.76 77.72,62.76 75.69,66.83 77.72,66.83 77.47,22.12 77.47,20.09 76.45,19.08 76.45,21.11 76.45,23.14 78.49,23.14 78.49,21.11 78.49,19.08
  pour Bottom: 0,81.31 0,0.03 101.09,0.03 101.09,81.31
  pour Top: 17.53,65.3 24.13,65.3 24.13,61.24 17.53,61.24
GPIO1
  Top 0.305: MCU.49 38.92,39.2 38.61,38.89 17.27,38.89 14.22,35.84 GPIO.3
I2C1_SCL  (via drill 0.6)
  Top 0.305: I2C.4 11.18,43.71 18.54,43.71 20.32,41.94 v36.83,41.94 | MCU.61 44.92,41.39 v44.96,40.41
  Bottom 0.305: v36.83,41.94 38.35,40.41 v44.96,40.41
I2C1_SDA  (via drill 0.6)
  Top 0.305: I2C.3 13.21,43.21 18.29,43.21 20.07,41.43 35.31,41.43 35.97,40.77 v36.83,40.77 | MCU.62 45.42,41.47 v46.74,40.16
  Bottom 0.305: v36.83,40.77 38.2,39.4 45.97,39.4 v46.74,40.16
JSSW  (via drill 0.6)
  Top 0.305: v34.29,59.72 34.29,54.89 v35.56,53.62 | v35.56,44.98 35.86,45.28 MCU.46
  Bottom 0.305: JSTK.5 47.75,56.67 42.93,61.49 36.07,61.49 v34.29,59.72 | v35.56,53.62 v35.56,44.98
JSX  (via drill 0.6)
  Top 0.305: v54.1,50.57 54.1,49.56 52.33,47.78 MCU.8
  Bottom 0.305: JSTK.3 58.42,52.6 57.15,51.33 54.86,51.33 v54.1,50.57
JSY  (via drill 0.6)
  Top 0.305: v52.58,50.57 52.58,49.3 51.56,48.29 MCU.9
  Bottom 0.305: JSTK.4 55.88,53.87 v52.58,50.57
N$1
  Top 0.305: DRV1.10 85.05,66.42 C1.1
N$2
  Top 0.305: D1.3 87.02,62.55 C1.2
N$3
  Top 0.305: DRV1.11 85.54,67.07 86.16,67.44 87.42,67.44
  Top 0.406: D1.2 C2.2 87.42,67.44
N$4
  Top 0.305: DRV2.10 86.07,45.59 C3.1
N$5
  Top 0.305: D2.3 87.91,41.85 C3.2
N$6
  Top 0.305: 79.94,46.25 89.47,46.25
  Top 0.406: D2.2 C4.2 89.47,46.25 | 79.94,46.25 DRV2.11
N$7  (via drill 0.6)
  Top 0.305: R1.1 86.61,54.89 v86.11,55.4 | v81.28,63.02 80.78,62.52 DRV1.4
  Bottom 0.305: v86.11,55.4 86.11,57.94 v81.28,63.02
N$8
  Top 0.305: DRV3.10 87.38,22.73 C5.1
N$9
  Top 0.305: D3.3 87.38,18.74 C5.2
N$10
  Top 0.406: D3.2 C6.2 80.45,23.39 DRV3.11
N$11
  Top 0.406: SW1.1 93.03,53.62 C11.1 91.82,53.69 R1.2
N$12  (via drill 0.6)
  Top 0.305: R2.1 86.11,33.05 v85.85,33.3 | v81.79,41.94 81.52,41.69 DRV2.4
  Bottom 0.305: v85.85,33.3 85.85,37.87 v81.79,41.94
N$13
  Top 0.406: SW2.1 98.36,31.84 C12.1 91.31,31.84 R2.2
N$14  (via drill 0.6)
  Top 0.305: DRV3.4 81.55,18.83 v81.79,19.08 | v86.61,10.44 88.46,10.44 R3.1
  Bottom 0.305: v81.79,19.08 86.61,14.25 v86.61,10.44
N$15
  Top 0.406: R3.2 91.56,9.74 C13.1 96.08,9.74 SW3.1
N$16
  Top 0.305: C14.1 OSC.1 58,44.9 57.15,45.75 52.32,45.75 51.82,46.25 48.45,46.25 MCU.5
N$17
  Top 0.305: C15.1 56,47.1 OSC.3 56.17,46.79 55.63,46.25 52.58,46.25 52.07,46.76 48.44,46.76 MCU.6
N$18  (via drill 0.6)
  Top 0.305: v31.5,43.21 32,42.7 36.32,42.7 v36.83,43.21 | v43.94,43.71 44.42,43.23 MCU.60
  Bottom 0.305: v31.5,43.21 31.5,58.19 30.48,59.21 BOOTJMP.2 | v36.83,43.21 37.34,43.71 v43.94,43.71
N$19
  Top 0.406: BOOTJMP.3 33.02,66.51 R4.2
N$20
  Top 0.406: R5.1 3.62,56.26 PWR.A
N$22
  Top 0.305: C30.1 39.92,56.44 MCU.30
N$23
  Top 0.305: R8.2 40.92,58.26 MCU.28
OSC32_IN
  Top 0.305: MCU.3 51.31,45.29 52.83,43.76 52.83,41.17 53.59,40.41 59.94,40.41 60.96,39.4 RTC.4
OSC32_OUT
  Top 0.305: MCU.4 51.61,45.8 53.34,44.07 53.34,41.43 53.85,40.92 61.98,40.92 63.5,39.4 RTC.5
RESET  (via drill 0.6)
  Top 0.305: DRV3.3 85.21,18.18 v85.6,18.57 | DRV2.3 84.96,41.04 v85.34,41.43 | DRV1.3 84.2,61.87 v84.58,62.26 | MCU.7 v54.88,47.28 | v63.25,53.62 67,53.62 v67.97,54.64 | v86.36,31.78 59.69,31.78 57.91,30 57.91,22.63 56.9,21.62 51.82,21.62 51.08,22.35 RST.1 51.03,23.65 48.51,23.65 47.75,24.41 47.75,25.93 | C31.1 47.75,25.93 | R6.1 44.2,26.7 44.96,25.93 47.75,25.93
  Bottom 0.305: v85.6,18.57 87.38,20.35 87.38,30.76 | 87.38,30.76 87.38,41.43 | 87.38,41.43 87.38,53.87 | 87.38,53.87 87.38,60.73 85.85,62.26 v84.58,62.26 | v85.34,41.43 87.38,41.43 | v54.88,47.28 56.91,47.28 v63.25,53.62 | v67.97,54.64 85.34,54.64 86.11,53.87 87.38,53.87 | 87.38,30.76 v86.36,31.78
RTC
  Top 0.305: MCU.2 50.8,44.78 52.32,43.26 52.32,40.92 53.34,39.9 57.91,39.9 58.42,39.4 RTC.3
SD_CLK  (via drill 0.6)
  Top 0.305: MCU.53 40.92,35.61 v40.13,34.82 | v40.13,27.71 41.4,26.44 41.4,5.11 39.32,2.92 37.96,2.92 MICROSD.CLK
  Bottom 0.305: v40.13,34.82 v40.13,27.71
SD_CMD  (via drill 0.6)
  Top 0.305: MCU.54 41.42,34.59 v24.89,18.31 | v18.54,17.55 18.54,6.38 21.34,3.58 22.72,3.58 MICROSD.CMD
  Bottom 0.305: v24.89,18.31 19.3,18.31 v18.54,17.55
SD_D0  (via drill 0.6)
  Top 0.305: MCU.39 32.27,48.78 v30.23,50.83 | v40.13,23.9 40.13,5.61 38.86,4.34 MICROSD.DAT0
  Bottom 0.305: v30.23,50.83 29.21,50.83 27.69,49.3 27.69,36.35 v40.13,23.9
SD_D1  (via drill 0.6)
  Top 0.305: MCU.40 31.25,48.28 v30.23,49.3 | v38.86,26.44 38.86,6.23 MICROSD.DAT1
  Bottom 0.305: v30.23,49.3 28.96,49.3 28.7,49.05 28.7,36.6 v38.86,26.44
SD_D2  (via drill 0.6)
  Top 0.305: MCU.51 39.92,36.9 20.07,17.04 20.07,9.17 v19.81,8.92 | v21.84,6.38 21.84,5.61 22.35,5.11 22.71,5.11 MICROSD.DAT2
  Bottom 0.305: v19.81,8.92 19.81,8.15 v21.84,6.38
SD_D3
  Top 0.305: MCU.52 40.42,36.38 20.83,16.79 20.83,5.36 21.84,4.34 MICROSD.DAT3/CD
SPI1_MISO  (via drill 0.6)
  Top 0.305: MCU.56 42.42,37.11 45.47,34.06 v71.88,34.06 71.88,35.33 70.36,36.86 v70.36,39.9 | DRV3.18 71.64,23.38 v71.37,23.65 | DRV2.18 69.86,46.24 v69.6,46.51 | DRV1.18 69.33,67.07 68.83,66.32 68.83,51.84 67.56,50.57 v67.56,49.3
  Bottom 0.305: v71.37,23.65 71.37,33.55 v71.88,34.06 | v70.36,39.9 70.36,45.75 v69.6,46.51 67.56,48.54 v67.56,49.3
SPI1_MOSI  (via drill 0.6)
  Top 0.305: MCU.57 42.92,37.37 45.47,34.82 67.56,34.82 | DRV3.20 69.64,22.08 v69.34,22.38 | v70.36,35.33 69.85,34.82 67.56,34.82 | DRV2.20 68.11,44.94 67.56,45.49 v67.56,46.76 67.56,48.03 68.83,49.56 v68.83,50.72 | v67.56,39.9 67.56,34.82 | DRV1.20 70.06,65.77 69.85,65.56 69.85,53.37 v70.61,52.6
  Bottom 0.305: v69.34,22.38 69.34,34.32 v70.36,35.33 | v67.56,46.76 v67.56,39.9 | v70.61,52.6 v68.83,50.72
SPI1_SCK  (via drill 0.6)
  Top 0.305: MCU.55 41.92,36.84 45.47,33.3 69.85,33.3 v70.36,32.79 | DRV3.19 70.51,22.73 v70.36,22.89 | DRV2.19 68.99,45.59 v68.58,46 68.58,48.29 69.85,49.81 69.85,52.35 69.34,52.86 69.34,66.07 69.7,66.42 DRV1.19 | v68.83,39.9 v68.83,36.35
  Bottom 0.305: v70.36,22.89 v70.36,32.79 70.36,33.81 71.63,35.08 71.63,35.59 70.87,36.35 v68.83,36.35 | v68.58,46 68.83,45.75 v68.83,39.9
SPI2_MISO  (via drill 0.6)
  Top 0.305: v29.97,53.87 33.53,53.87 34.8,52.6 v36.58,52.6 | v46.48,48.29 46.98,48.78 MCU.10
  Bottom 0.305: SPI.3 25.15,31.01 25.15,52.35 26.67,53.87 v29.97,53.87 | v36.58,52.6 38.1,52.6 39.12,53.62 42.16,53.62 45.72,50.06 45.72,49.05 v46.48,48.29
SPI2_MOSI  (via drill 0.6)
  Top 0.305: SPI.4 26.42,34.82 v34.8,34.82 | v39.62,45.49 39.62,44.98 37.85,43.21 37.85,39.9 35.31,39.9 v34.8,40.41 | v41.66,45.49 45.49,49.28 MCU.11
  Bottom 0.305: v34.8,34.82 v34.8,40.41 | v39.62,45.49 v41.66,45.49
SPI2_SCK  (via drill 0.6)
  Top 0.305: SPI.5 15.24,24.41 26.67,35.84 v33.53,35.84 | v33.53,39.9 34.04,39.4 38.1,39.4 38.35,39.65 38.35,42.95 40.42,45.02 40.42,49.08 v40.89,49.56 | v40.89,52.35 40.42,52.82 MCU.29
  Bottom 0.305: v33.53,35.84 v33.53,39.9 | v40.89,49.56 v40.89,52.35
USART1_RX  (via drill 0.6)
  Top 0.305: MCU.59 43.92,39.16 v46.23,36.86 | UART.3 7.62,21.62 22.86,36.86 v36.83,36.86
  Bottom 0.305: v46.23,36.86 v36.83,36.86
USART1_TX  (via drill 0.6)
  Top 0.305: v38.1,37.87 23.11,37.87 9.4,24.16 UART.4 | MCU.58 43.42,38.39 v43.94,37.87
  Bottom 0.305: v43.94,37.87 v38.1,37.87
USB_DM  (via drill 0.6)
  Top 0.305: USB.D-1 7.51,48.43 v8.13,49.05 12.95,49.05 15.75,46.25 36.89,46.25 MCU.44
  Bottom 0.305: v8.13,49.05 10.52,49.05 ESD.I/O3
USB_DP  (via drill 0.6)
  Top 0.305: USB.D+1 7.62,47.78 v8.13,47.27 13.77,47.27 15.3,45.75 MCU.45
  Bottom 0.305: ESD.I/O2 10.7,46.51 8.89,46.51 v8.13,47.27
USB_EN
  Top 0.305: CUR.3 21.37,50.03 23.62,47.78 MCU.41
USB_ID  (via drill 0.6)
  Top 0.305: USB.ID1 7,47.13 8.64,45.49 v11.68,45.49 v13.46,45.49 | v16,47.52 16.76,46.76 36.9,46.76 MCU.43
  Bottom 0.305: v11.68,45.49 11.68,46.11 ESD.I/O1 | v13.46,45.49 14.48,45.49 v16,47.52
USB_VBUS  (via drill 0.6)
  Top 0.305: 11.43,50.32 14.48,50.32 17.53,47.27 36.91,47.27 MCU.42
  Top 0.406: USB.VBUS1 6.89,49.08 8.13,50.32 v10.67,50.32 11.43,50.32 | 11.43,50.32 11.43,54.52 D5.A | 11.43,50.32 13.72,52.6 17.82,52.6 CUR.5
  Bottom 0.305: v10.67,50.32 11.18,49.91 ESD.VCC
V+
  Top 0.305: 18.06,55.4 18.29,55.4 18.8,54.89
  Top 0.406: D5.C 16.51,55.4 | 16.51,55.4 18.06,55.4 VREG.1 | C16.1 15.75,59.46 16.26,58.95 16.26,55.65 16.51,55.4 | CUR.1 17.85,50.64 18.8,51.59 18.8,54.89
VCC  (via drill 0.6, 0.7)
  Top 0.305: DRV3.26 71.5,18.18 | 79.93,40.41 DRV2.2 | 91.5,46.95 C4.1 | 81.79,40.41 v82.04,40.16
  Top 0.406: 80.46,17.55 DRV3.2 81.53,17.53 81.81,17.53 | DRV3.16 73.13,24.68 | v82.3,24.41 82.3,24.29 82.04,24.03 DRV3.12 | DRV2.12 81.41,46.89 | 71.61,47.54 DRV2.16 | DRV1.16 71.35,68.37 | 79.93,40.41 81.79,40.41 | 81.84,60.9 81.65,61.1 81.65,61.11 81.54,61.22 DRV1.2
  Top 0.61: C2.1 D1.1 | C2.1 91.31,67.21 91.95,66.57 92,61.9 91.49,61.39 91.39,61.29 91,60.9 81.84,60.9 | D2.1 C4.1 92.71,44.92 92.71,41.43 91.69,40.16 v82.04,40.16 | D3.1 C6.1 | C6.1 92.46,23.39 93.22,22.63 93.22,19.08 91.69,17.55 81.53,17.53 | 82.3,24.29 88.02,24.29 88.65,24.66 91.19,24.66 91.63,24.22 C6.1 | 73.13,24.68 v72.64,25.17 | 81.81,17.53 v82.3,17.04 | DRV2.26 72.77,41.04 v72.49,41.02 | 91.5,46.95 90.93,47.52 88.14,47.52 87.51,46.89 81.41,46.89 v82.04,47.52 | v70.87,48.29 71.61,47.54 | 71.35,68.37 v70.36,69.11 | 81.41,67.72 v81.38,68.61 | DRV1.12 81.41,67.72 | 81.41,67.72 85.22,67.72 86.46,68.45 89.26,68.45 89.85,68.16 C2.1 | v72.39,61.49 72.77,61.87 DRV1.26 | 81.54,61.22 82.4,60.36 v82.4,60.33
  Top 1.27: 71.5,18.18 66.92,18.18 v65.79,17.3
  Top 1.422: 63.88,17.17 C8.1
  Top 1.778: MTR+.2 MTR+.1 75.95,5.11 72.9,8.15 | 72.9,8.15 65.79,15.27 | 65.79,15.27 v65.79,17.3 | 72.9,8.15 C7.+ | 65.79,15.27 63.88,17.17
  Bottom 0.305: 71.63,47.52 v70.87,48.29 | 66.04,69.11 65.79,68.86
  Bottom 0.61: v72.64,25.17 81.79,25.17 v82.3,24.41 | v82.3,17.04 81.79,17.3 v65.79,17.3 | 65.79,38.89 70.87,38.89 v72.49,41.02 73.41,40.16 v82.04,40.16 | v82.04,47.52 71.63,47.52 | 66.04,69.11 v70.36,69.11 71.12,68.61 v81.38,68.61 | v82.4,60.33 81.28,61.49 v72.39,61.49
  Bottom 1.778: v65.79,17.3 65.79,38.89 65.79,68.86

### Text on the board
tPlace: Stepper Driver v1 / John Barry / Anthony Lombardi / / ME 507 / Fall 2016